# Altium project BLDC_Gimbal.PrjPcb (part 1 of 3)
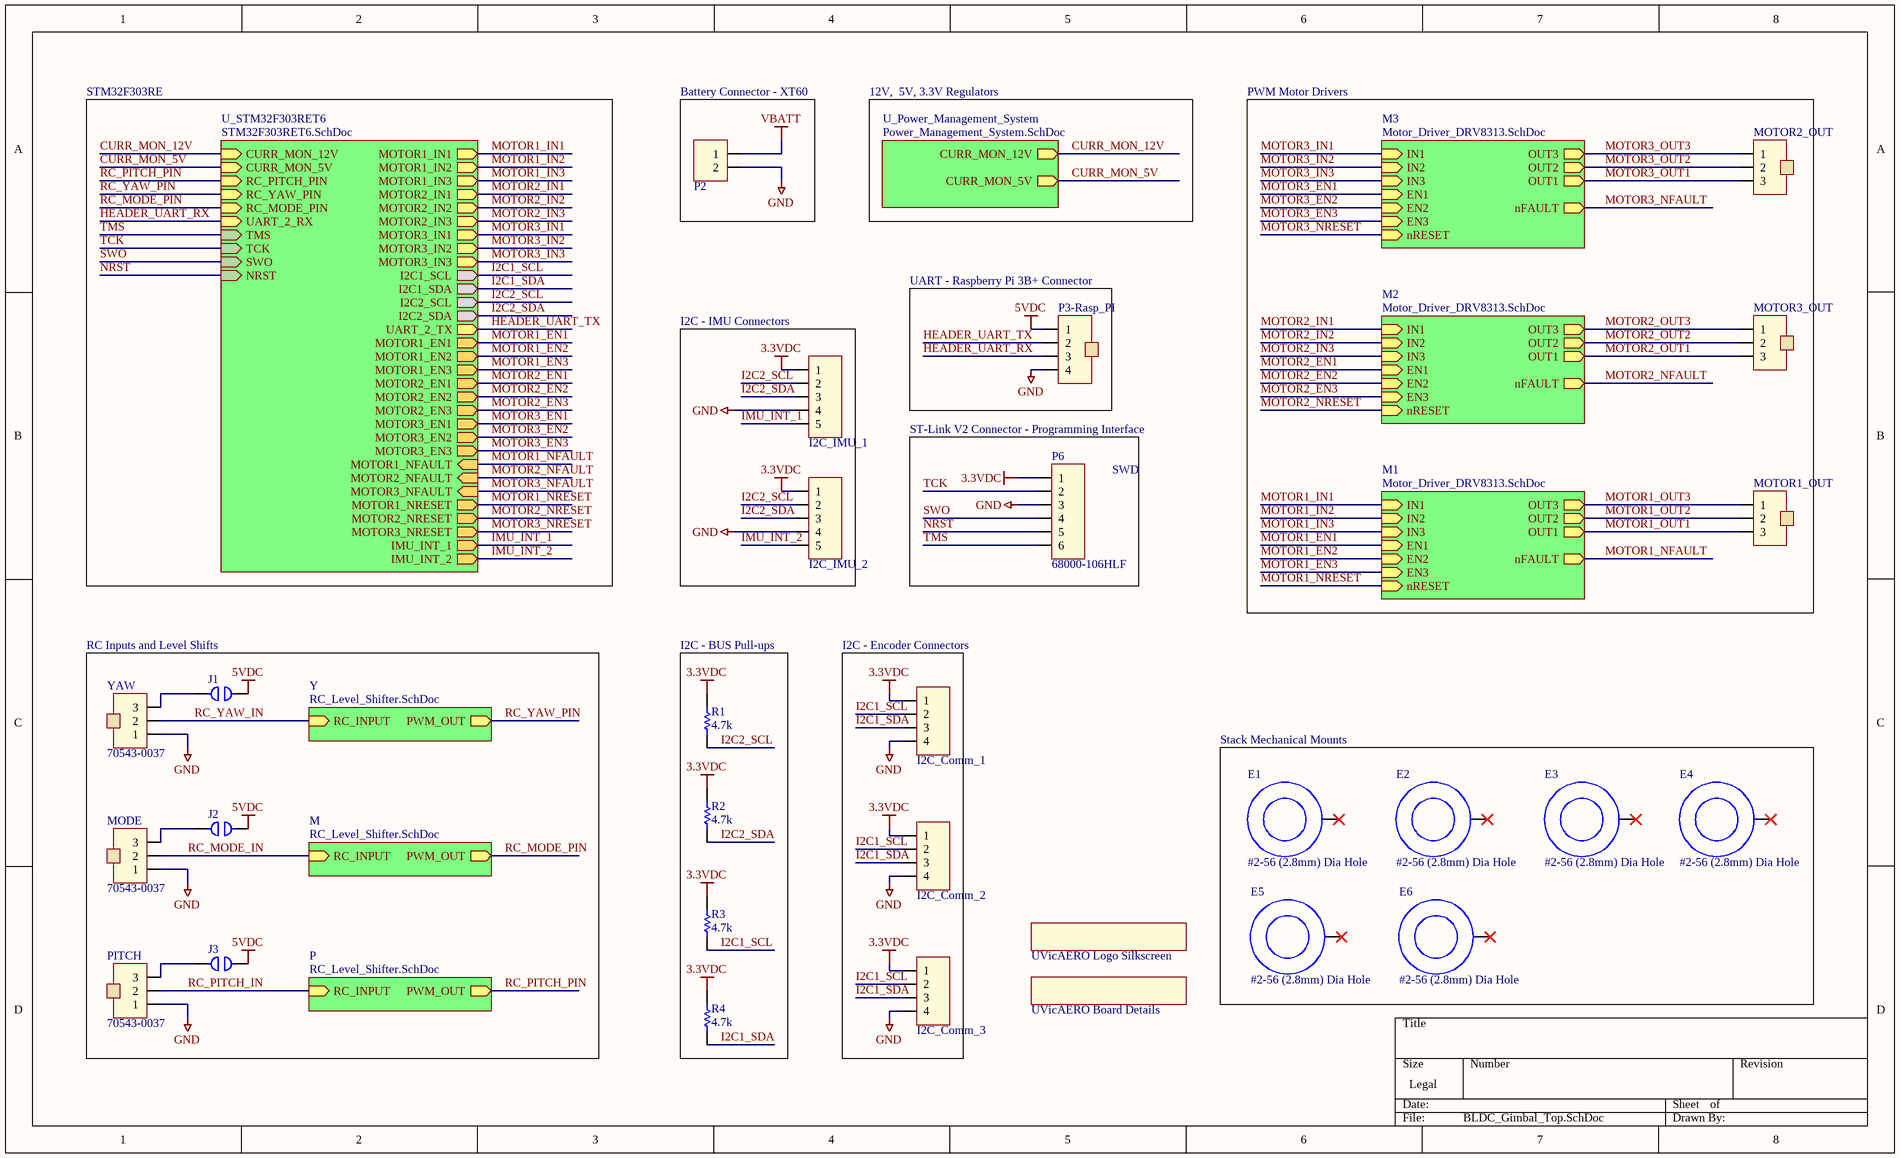
[diagram p0: BLDC_Gimbal_Top.SchDoc]
5 sheets, 131 parts. Net scope: hierarchical (ports join the sheet entries above them; power ports are global).
Board file: BLDC_Gimbal.PcbDoc
Sheets:
  BLDC_Gimbal_Top.SchDoc
    M1 = Motor_Driver_DRV8313.SchDoc
    M2 = Motor_Driver_DRV8313.SchDoc
    M3 = Motor_Driver_DRV8313.SchDoc
    U_Power_Management_System = Power_Management_System.SchDoc
    Y = RC_Level_Shifter.SchDoc
    M = RC_Level_Shifter.SchDoc
    P = RC_Level_Shifter.SchDoc
    U_STM32F303RET6 = STM32F303RET6.SchDoc

## Sheet BLDC_Gimbal_Top.SchDoc: BLDC_Gimbal_Top
size Legal; Date: 2019-06-12; CompanyName: UVic AERO; Engineer: Alexander Cote; DocumentNumber: 1; SheetNumber: 1; SheetTotal: 5

### Parts
E1  #2-56 (2.8mm) Dia Hole  [2-56, Mounting Hole]  (no BOM)
E2  #2-56 (2.8mm) Dia Hole  [2-56, Mounting Hole]  (no BOM)
E3  #2-56 (2.8mm) Dia Hole  [2-56, Mounting Hole]  (no BOM)
E4  #2-56 (2.8mm) Dia Hole  [2-56, Mounting Hole]  (no BOM)
E5  #2-56 (2.8mm) Dia Hole  [2-56, Mounting Hole]  (no BOM)
E6  #2-56 (2.8mm) Dia Hole  [2-56, Mounting Hole]  (no BOM)
I2C_Comm_1  B4B-ZR-SM4-TF(LF)(SN)  [1x4-PIN ZH 1.5mm Pitch]  (value not drawn)
I2C_Comm_2  B4B-ZR-SM4-TF(LF)(SN)  [1x4-PIN ZH 1.5mm Pitch]  (value not drawn)
I2C_Comm_3  B4B-ZR-SM4-TF(LF)(SN)  [1x4-PIN ZH 1.5mm Pitch]  (value not drawn)
I2C_IMU_1  B5B-ZR-SM4-TF(LF)(SN)  [1x5-PIN ZH 1.5mm Pitch]  (value not drawn)
I2C_IMU_2  B5B-ZR-SM4-TF(LF)(SN)  [1x5-PIN ZH 1.5mm Pitch]  (value not drawn)
J1  3M9580-ND  [Jumper-2Pin, THT]  (value not drawn)
J2  3M9580-ND  [Jumper-2Pin, THT]  (value not drawn)
J3  3M9580-ND  [Jumper-2Pin, THT]  (value not drawn)
LB1  UVicAERO Board Details  [UVicAERO, Board Details, Silkscreen]
LB2  UVicAERO Logo Silkscreen  [UVicAERO_Logo, 7mm Width]
MODE  70543-0037  [Header-3Pin, THT, Shrouded]
MOTOR1_OUT  70543-0037  [Header-3Pin, THT, Shrouded]  (value not drawn)
MOTOR2_OUT  70543-0037  [Header-3Pin, THT, Shrouded]  (value not drawn)
MOTOR3_OUT  70543-0037  [Header-3Pin, THT, Shrouded]  (value not drawn)
P2  2x1-Pin, Pitch: 3.00mm, Battery Connector  [XT60]  (value not drawn)
P3-Rasp_PI  43045-0412  [Header-4Pin, 2x2, THT, Locking, Tin]  (value not drawn)
P6  68000-106HLF  [Header-6Pin, THT]
PITCH  70543-0037  [Header-3Pin, THT, Shrouded]
R1  4.7k  [RESC2012N(0805")]
R2  4.7k  [RESC2012N(0805")]
R3  4.7k  [RESC2012N(0805")]
R4  4.7k  [RESC2012N(0805")]
YAW  70543-0037  [Header-3Pin, THT, Shrouded]

### Blocks framed on the sheet
Battery Connector - XT60: P2
PWM Motor Drivers: MOTOR1_OUT MOTOR2_OUT MOTOR3_OUT
UART - Raspberry Pi 3B+ Connector: P3-Rasp_PI
I2C - IMU Connectors: I2C_IMU_1 I2C_IMU_2
RC Inputs and Level Shifts: J1-J3 MODE PITCH YAW
I2C - BUS Pull-ups: R1-R4
I2C - Encoder Connectors: I2C_Comm_1-I2C_Comm_3
Stack Mechanical Mounts: E1-E6

### Sub-sheets
M = RC_Level_Shifter.SchDoc: RC_INPUT (in), PWM_OUT (out)
M1 = Motor_Driver_DRV8313.SchDoc: nFAULT (out), OUT1 (out), OUT2 (out), OUT3 (out), IN1 (in), IN2 (in), IN3 (in), EN1 (in), EN2 (in), EN3 (in), nRESET (in)
M2 = Motor_Driver_DRV8313.SchDoc: nFAULT (out), OUT1 (out), OUT2 (out), OUT3 (out), IN1 (in), IN2 (in), IN3 (in), EN1 (in), EN2 (in), EN3 (in), nRESET (in)
M3 = Motor_Driver_DRV8313.SchDoc: nFAULT (out), OUT1 (out), OUT2 (out), OUT3 (out), IN1 (in), IN2 (in), IN3 (in), EN1 (in), EN2 (in), EN3 (in), nRESET (in)
P = RC_Level_Shifter.SchDoc: RC_INPUT (in), PWM_OUT (out)
U_Power_Management_System = Power_Management_System.SchDoc: CURR_MON_12V (out), CURR_MON_5V (out)
U_STM32F303RET6 = STM32F303RET6.SchDoc: MOTOR1_IN1 (out), MOTOR1_IN2 (out), MOTOR1_IN3 (out), MOTOR2_IN1 (out), MOTOR2_IN2 (out), MOTOR2_IN3 (out), MOTOR3_IN1 (out), MOTOR3_IN2 (out), MOTOR3_IN3 (out), I2C1_SCL (out), I2C1_SDA (out), I2C2_SCL (out), I2C2_SDA (out), CURR_MON_12V (in), CURR_MON_5V (in), RC_PITCH_PIN (in), RC_YAW_PIN (in), RC_MODE_PIN (in), UART_2_TX (out), UART_2_RX (in), MOTOR1_EN1 (out), MOTOR1_EN2 (out), MOTOR1_EN3 (out), MOTOR2_EN1 (out), MOTOR2_EN2 (out), MOTOR2_EN3 (out), MOTOR3_EN1 (out), MOTOR3_EN2 (out), MOTOR3_EN3 (out), MOTOR1_NFAULT (in), MOTOR2_NFAULT (in), MOTOR3_NFAULT (in), MOTOR1_NRESET (out), MOTOR2_NRESET (out), MOTOR3_NRESET (out), IMU_INT_1 (out), IMU_INT_2 (out), TMS (in), TCK (in), SWO (in), NRST (in)
Y = RC_Level_Shifter.SchDoc: RC_INPUT (in), PWM_OUT (out)

### Nets
3.3VDC: I2C_Comm_1.1 I2C_Comm_2.1 I2C_Comm_3.1 I2C_IMU_1.1 I2C_IMU_2.1 P6.1 R1.2 R2.2 R3.2 R4.2
5VDC: J1.2 J2.2 J3.2 P3-Rasp_PI.1
GND: I2C_Comm_1.4 I2C_Comm_2.4 I2C_Comm_3.4 I2C_IMU_1.4 I2C_IMU_2.4 MODE.1 P2.2 P3-Rasp_PI.4 P6.3 PITCH.1 YAW.1
VBATT: P2.1
CURR_MON_5V: sheet U_Power_Management_System/CURR_MON_5V, sheet U_STM32F303RET6/CURR_MON_5V
CURR_MON_12V: sheet U_Power_Management_System/CURR_MON_12V, sheet U_STM32F303RET6/CURR_MON_12V
HEADER_UART_RX: P3-Rasp_PI.3 ; sheet U_STM32F303RET6/UART_2_RX
HEADER_UART_TX: P3-Rasp_PI.2 ; sheet U_STM32F303RET6/UART_2_TX
I2C1_SCL: I2C_Comm_1.2 I2C_Comm_2.2 I2C_Comm_3.2 R3.1 ; sheet U_STM32F303RET6/I2C1_SCL
I2C1_SDA: I2C_Comm_1.3 I2C_Comm_2.3 I2C_Comm_3.3 R4.1 ; sheet U_STM32F303RET6/I2C1_SDA
I2C2_SCL: I2C_IMU_1.2 I2C_IMU_2.2 R1.1 ; sheet U_STM32F303RET6/I2C2_SCL
I2C2_SDA: I2C_IMU_1.3 I2C_IMU_2.3 R2.1 ; sheet U_STM32F303RET6/I2C2_SDA
IMU_INT_1: I2C_IMU_1.5 ; sheet U_STM32F303RET6/IMU_INT_1
IMU_INT_2: I2C_IMU_2.5 ; sheet U_STM32F303RET6/IMU_INT_2
MOTOR1_EN1: sheet M1/EN1, sheet U_STM32F303RET6/MOTOR1_EN1
MOTOR1_EN2: sheet M1/EN2, sheet U_STM32F303RET6/MOTOR1_EN2
MOTOR1_EN3: sheet M1/EN3, sheet U_STM32F303RET6/MOTOR1_EN3
MOTOR1_IN1: sheet M1/IN1, sheet U_STM32F303RET6/MOTOR1_IN1
MOTOR1_IN2: sheet M1/IN2, sheet U_STM32F303RET6/MOTOR1_IN2
MOTOR1_IN3: sheet M1/IN3, sheet U_STM32F303RET6/MOTOR1_IN3
MOTOR1_NFAULT: sheet M1/nFAULT, sheet U_STM32F303RET6/MOTOR1_NFAULT
MOTOR1_NRESET: sheet M1/nRESET, sheet U_STM32F303RET6/MOTOR1_NRESET
MOTOR1_OUT1: MOTOR1_OUT.3 ; sheet M1/OUT1
MOTOR1_OUT2: MOTOR1_OUT.2 ; sheet M1/OUT2
MOTOR1_OUT3: MOTOR1_OUT.1 ; sheet M1/OUT3
MOTOR2_EN1: sheet M2/EN1, sheet U_STM32F303RET6/MOTOR2_EN1
MOTOR2_EN2: sheet M2/EN2, sheet U_STM32F303RET6/MOTOR2_EN2
MOTOR2_EN3: sheet M2/EN3, sheet U_STM32F303RET6/MOTOR2_EN3
MOTOR2_IN1: sheet M2/IN1, sheet U_STM32F303RET6/MOTOR2_IN1
MOTOR2_IN2: sheet M2/IN2, sheet U_STM32F303RET6/MOTOR2_IN2
MOTOR2_IN3: sheet M2/IN3, sheet U_STM32F303RET6/MOTOR2_IN3
MOTOR2_NFAULT: sheet M2/nFAULT, sheet U_STM32F303RET6/MOTOR2_NFAULT
MOTOR2_NRESET: sheet M2/nRESET, sheet U_STM32F303RET6/MOTOR2_NRESET
MOTOR2_OUT1: MOTOR3_OUT.3 ; sheet M2/OUT1
MOTOR2_OUT2: MOTOR3_OUT.2 ; sheet M2/OUT2
MOTOR2_OUT3: MOTOR3_OUT.1 ; sheet M2/OUT3
MOTOR3_EN1: sheet M3/EN1, sheet U_STM32F303RET6/MOTOR3_EN1
MOTOR3_EN2: sheet M3/EN2, sheet U_STM32F303RET6/MOTOR3_EN2
MOTOR3_EN3: sheet M3/EN3, sheet U_STM32F303RET6/MOTOR3_EN3
MOTOR3_IN1: sheet M3/IN1, sheet U_STM32F303RET6/MOTOR3_IN1
MOTOR3_IN2: sheet M3/IN2, sheet U_STM32F303RET6/MOTOR3_IN2
MOTOR3_IN3: sheet M3/IN3, sheet U_STM32F303RET6/MOTOR3_IN3
MOTOR3_NFAULT: sheet M3/nFAULT, sheet U_STM32F303RET6/MOTOR3_NFAULT
MOTOR3_NRESET: sheet M3/nRESET, sheet U_STM32F303RET6/MOTOR3_NRESET
MOTOR3_OUT1: MOTOR2_OUT.3 ; sheet M3/OUT1
MOTOR3_OUT2: MOTOR2_OUT.2 ; sheet M3/OUT2
MOTOR3_OUT3: MOTOR2_OUT.1 ; sheet M3/OUT3
NRST: P6.5 ; sheet U_STM32F303RET6/NRST
RC_MODE_IN: MODE.2 ; sheet M/RC_INPUT
RC_MODE_PIN: sheet M/PWM_OUT, sheet U_STM32F303RET6/RC_MODE_PIN
RC_PITCH_IN: PITCH.2 ; sheet P/RC_INPUT
RC_PITCH_PIN: sheet P/PWM_OUT, sheet U_STM32F303RET6/RC_PITCH_PIN
RC_YAW_IN: YAW.2 ; sheet Y/RC_INPUT
RC_YAW_PIN: sheet Y/PWM_OUT, sheet U_STM32F303RET6/RC_YAW_PIN
SWO: P6.4 ; sheet U_STM32F303RET6/SWO
TCK: P6.2 ; sheet U_STM32F303RET6/TCK
TMS: P6.6 ; sheet U_STM32F303RET6/TMS
NetJ1_1: J1.1 YAW.3
NetJ2_1: J2.1 MODE.3
NetJ3_1: J3.1 PITCH.3

Not connected (* = marked no-connect by the designer): E1 0*; E2 0*; E3 0*; E4 0*; E5 0*; E6 0*

### Notes on the sheet
- STM32F303RE
- 12V,  5V, 3.3V Regulators
- ST-Link V2 Connector - Programming Interface
- (near P6) SWD
- Title
- Size:
- Date:
- Legal
- Number:
- Time:
- Revision:
- Sheet
- of
- File:

### Library data of the parts
E1-E6 = #2-56, w-Pin, Mounting Hole: #2-56, with Pin, Mounting Hole; Publisher: UVic AERO, KCMR; Published: Feb 8, 2014
I2C_Comm_1-I2C_Comm_3 = B4B-ZR-SM4-TF(LF)(SN): Conn Shrouded Header HDR 4 POS 1.5mm Solder ST SMD T/R; Manufacturer: JST; Number of Positions: 4; Current Rating: 1A; Gender: Male; Connector Type: Male Pin; Contact Resistance: 30mR; Max Voltage Rating (AC): 50V; Supplier 1: Digi-Key; Manufacturer Part Number: B4B-ZR-SM4-TF(LF)(SN); Stock 1: 27718; Pricing 1: 1 = 0.71000, 10 = 0.67000, 100 = 0.51380, 500 = 0.44682 (USD); RoHS: Yes; Mount: Surface Mount; Contact Plating: Tin; Contact Material: Tin; Color: Natural; Housing Color: Beige; Housing Material: Polyamide; Min Operating Temperature: -25°C; Max Operating Temperature: 85°C; Number of Rows: 1; Packaging: Tape and Reel; Termination: Solder; Number of Contacts: 4; Max Current Rating: 1A; Fastening Type: Detent; Orientation: Straight; Length: 9mm; Height: 7.2mm; Pitch: 1.5mm; Width: 3.5mm; Depth: 3.7mm; Lead Free: Lead Free; ComponentLink1URL: https://datasheet.ciiva.com/26924/getdatasheetpartid-640935-26924037.pdf?src-supplier=Verical; ComponentLink1Description: https://datasheet.ciiva.com/26924/getdatasheetpartid-640935-26924037.pdf?src-supplier=Verical; Supplier Part Number 1: 455-1683-1-ND
I2C_IMU_1 I2C_IMU_2 = B5B-ZR-SM4-TF(LF)(SN): CONN HEADER ZH TOP 5POS 1.5MM; Manufacturer: JST; Number of Positions: 5; Gender: Male; Current Rating: 1A; Connector Type: Male Pin; Pitch: 0.059inch; Supplier 1: Digi-Key; Manufacturer Part Number: B5B-ZR-SM4-TF(LF)(SN); Stock 1: 52019; Pricing 1: 1 = 0.790000, 10 = 0.742000, 100 = 0.568600, 500 = 0.494420 (USD); RoHS: Yes; Mount: Surface Mount; Contact Material: Tin; Contact Plating: Tin; Housing Color: Natural; Housing Material: Nylon; Color: Natural; Number of Rows: 1; Packaging: Tape and Reel; Number of Contacts: 5; Termination: Solder; Fastening Type: Detent; Length: 10.5mm; Height: 7.2mm; Width: 3.5mm; Lead Free: Lead Free; ComponentLink1URL: http://www.jst-mfg.com/product/pdf/eng/eZH.pdf?src-supplier=Digi-Key; ComponentLink1Description: http://www.jst-mfg.com/product/pdf/eng/eZH.pdf?src-supplier=Digi-Key; ComponentLink2URL: http://www.jst-mfg.com/product/pdf/eng/eZR.pdf?src-supplier=Future+Electronics; ComponentLink2Description: http://www.jst-mfg.com/product/pdf/eng/eZR.pdf?src-supplier=Future+Electronics; Supplier Part Number 1: 455-1684-1-ND
J1-J3 = Jumper, 0.1" (2.54mm), Gold, THT, 68001-202HLF: Jumper, 0.1" (2.54mm), Gold, THT, 68001-202HLF & 3M9580-ND; Mfg: FCI; Publisher: UVic AERO, Kirk Richardson; Published: 2014-10-19; LatestRevisionNote: *; LatestRevisionDate: *; Mfg#: 68001-202HLF; Verified: No; ReviewedBy: *; ReviewedDate: *; LatestRevisionBy: *; Supplier 1: Digi-Key; Supplier 2: Digi-Key; Supplier Part Number 1: 3M9580-ND; Supplier Part Number 2: 609-3469-ND
LB1 = Logo, UVic AERO, Board Details: Logo, UVic AERO, Board Details, Silkscreen; Publisher: UVic AERO, KCMR; Published: Feb 14, 2014
LB2 = Logo, UVic AERO 2014, 7mm: Logo, UVic AERO 2014, 7mm Width, Silkscreen; Publisher: UVic AERO, KCMR; Published: Feb 14, 2014
MODE MOTOR1_OUT MOTOR2_OUT MOTOR3_OUT PITCH YAW = 1x3-Pin, Pitch: 0.1" (2.54mm), Tin, THT, Shrouded, Locking, 70543-0037: Mfg: Molex Inc; ReviewedBy: Matthew Fitz; ReviewedNote: There should be tin pins instead of gold; Publisher: UVic AERO, Kirk Richardson; Published: 2014-03-16; LatestRevisionNote: Changed # of pins from 4 to 3; LatestRevisionDate: 2014-03-18; Mfg#: 70543-0037; ReviewedDate: 2014-03-19; Verified: Yes; Supplier 1: Digi-Key; Supplier Part Number 1: WM4825-ND; LatestRevisionBy: *
P2 = 2x1-Pin, Pitch: 3.00mm, Battery Connector: XT60 - 2x1-Pin, Pitch: 3.00mm, Battery Connector; Publisher: UVic AERO, Luke Mills; Published: 2016-12-15; ReviewedBy: *; ReviewedDate: *; Verified: *
P3-Rasp_PI = 2x2-Pin, Pitch: 3.00mm, Tin, THT, 43045-0412: 2x2-Pin, Pitch: 3.00mm, Tin, THT, Shrouded, Locking, 43045-0412; Mfg: Molex; ReviewedBy: Kirk Richardson; Publisher: UVic AERO, Taylor Eby; Published: 2014-03-13; LatestRevisionNote: Fixed footprint so it's aligned to pin 1; LatestRevisionDate: 2014-03-23; ReviewedDate: 2014-03-23; Verified: Yes; Supplier 1: Digi-Key; Supplier Part Number 1: WM1790-ND; Mfg#: 43045-0412; LatestRevisionBy: Kirk Richardson; ReviewedNote: *
P6 = Header, 1x6-Pin, Pitch: 0.1" (2.54mm), Gold 30µin, THT, 68000-106HLF: Mfg: FCI; Publisher: UVic AERO, Kirk Richardson; Published: 2014-03-16; LatestRevisionNote: *; LatestRevisionDate: *; ReviewedBy: *; ReviewedDate: *; Verified: No; Mfg#: 68000-106HLF; LatestRevisionBy: *; Supplier 1: Digi-Key; Supplier Part Number 1: 609-3249-ND
R1-R4 = RC0805FR-074K7L: RES SMD 4.7k ohm, 150 V, 0805 [2012 Metric], 250 mW,  1%; Manufacturer: Yageo; Resistance: 4.7kR; Temperature Coefficient: 100ppm/°C; Voltage Rating (DC): 150V; Power Rating: 125mW; Supplier 1: Digi-Key; Manufacturer Part Number: RC0805FR-074K7L; Stock 1: 5392599; Pricing 1: 1 = 0.10000, 10 = 0.04200, 100 = 0.01700, 1000 = 0.00762, 2500 = 0.00662 (USD); RoHS: Yes; Case/Package: 0805; Number of Pins: 2; Case Code (Metric): 2012; Case Code (Imperial): 0805; Min Operating Temperature: -55°C; Max Operating Temperature: 155°C; Tolerance: 1%; Composition: Thick Film; Packaging: Tape and Reel; Package Quantity: 5000; Voltage Rating: 150V; Number of Terminations: 2; Termination: SMD/SMT; Military Standard: Not; Max Power Dissipation: 125mW; Features: Moisture Resistant; Length: 0.079inch; Height: 0.024inch; Width: 0.049inch; Depth: 1.25mm; REACH SVHC: No SVHC; Lead Free: Lead Free; ComponentLink1URL: https://datasheet.ciiva.com/11808/0900766b8106beab-11808155.pdf?src-supplier=RSComponents; ComponentLink1Description: https://datasheet.ciiva.com/11808/0900766b8106beab-11808155.pdf?src-supplier=RSComponents; ComponentLink2URL: https://datasheet.ciiva.com/7941/1686128-7941805.pdf?src-supplier=Element14; ComponentLink2Description: https://datasheet.ciiva.com/7941/1686128-7941805.pdf?src-supplier=Element14; ComponentLink3URL: https://datasheet.ciiva.com/7941/444164-7941806.pdf?src-supplier=Element14; ComponentLink3Description: https://datasheet.ciiva.com/7941/444164-7941806.pdf?src-supplier=Element14; ComponentLink4URL: https://datasheet.ciiva.com/6547/pyu-r-int-thick-7-6547263.pdf?src-supplier=Digi-Key; ComponentLink4Description: https://datasheet.ciiva.com/6547/pyu-r-int-thick-7-6547263.pdf?src-supplier=Digi-Key; ComponentLink5URL: https://datasheet.ciiva.com/7941/444164-7941804.pdf?src-supplier=Element14; ComponentLink5Description: https://datasheet.ciiva.com/7941/444164-7941804.pdf?src-supplier=Element14; ComponentLink6URL: https://datasheet.ciiva.com/46447/444164-46447583.pdf?src-supplier=Element14; ComponentLink6Description: https://datasheet.ciiva.com/46447/444164-46447583.pdf?src-supplier=Element14; Supplier Part Number 1: 311-4.70KCRCT-ND

## Sheet Motor_Driver_DRV8313.SchDoc
size A4; CheckedBy: Jake Vidal, Noah Rondeau, Alexander Cote; DrawnBy: Alexander Cote; DocumentNumber: 2; Revision: 1.3; SheetNumber: 2; SheetTotal: 5
Used 3 times, as channels M1, M2, M3. Parts and nets are listed once, with the designators drawn on the sheet.
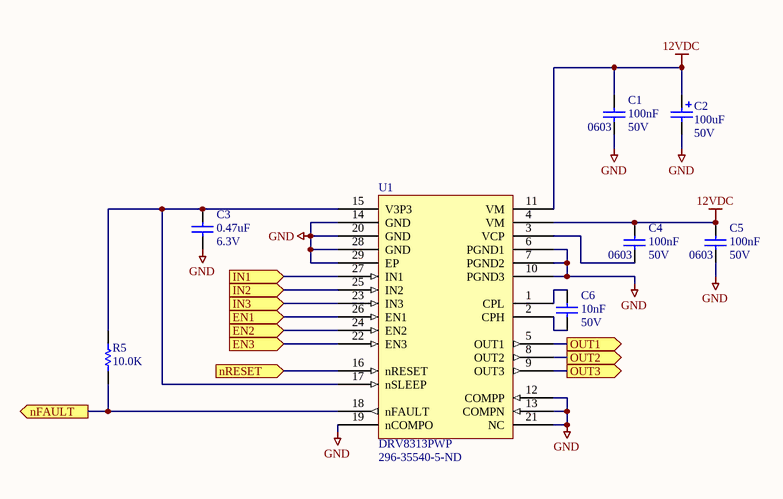
[diagram p1: Motor_Driver_DRV8313.SchDoc]

### Parts
C1  100nF  Case Code (Imperial): 0603  Voltage Rating: 50V  [CAPC1608N(0603")]
C2  100uF  Voltage: 50V  [CAPAE10083X105M]
C3  0.47uF  Voltage: 6.3V  [CAPC1608N(0603")]
C4  100nF  Case Code (Imperial): 0603  Voltage Rating: 50V  [CAPC1608N(0603")]
C5  100nF  Case Code (Imperial): 0603  Voltage Rating: 50V  [CAPC1608N(0603")]
C6  10nF  Voltage: 50V  [CAPC1608N(0603")]
R5  10.0K  [RESC1608N(0603")]
U1  DRV8313PWP  Supplier Part Number 1: 296-35540-5-ND  [HTSSOP-28]

### Ports
EN1 (in), EN2 (in), EN3 (in), IN1 (in), IN2 (in), IN3 (in), nFAULT (out), nRESET (in), OUT1 (out), OUT2 (out), OUT3 (out)

### Nets
12VDC: C1.2 C2.1 C4.2 C5.2 U1.4(VM) U1.11(VM)
GND: C1.1 C2.2 C3.2 C5.1 U1.6(PGND1) U1.7(PGND2) U1.10(PGND3) U1.12(COMPP) U1.13(COMPN) U1.14(GND) U1.19(nCOMPO) U1.20(GND) U1.21(NC) U1.28(GND) U1.29(EP)
EN1: U1.26(EN1) ; port EN1
EN2: U1.24(EN2) ; port EN2
EN3: U1.22(EN3) ; port EN3
IN1: U1.27(IN1) ; port IN1
IN2: U1.25(IN2) ; port IN2
IN3: U1.23(IN3) ; port IN3
nFAULT: R5.1 U1.18(nFAULT) ; port nFAULT
nRESET: U1.16(nRESET) ; port nRESET
OUT1: U1.5(OUT1) ; port OUT1
OUT2: U1.8(OUT2) ; port OUT2
OUT3: U1.9(OUT3) ; port OUT3
NetC3_1: C3.1 R5.2 U1.15(V3P3) U1.17(nSLEEP)
NetC4_1: C4.1 U1.3(VCP)
NetC6_1: C6.1 U1.2(CPH)
NetC6_2: C6.2 U1.1(CPL)

### Channels
M1: designators end in _Motor1_Pitch; ports EN1=MOTOR1_EN1 EN2=MOTOR1_EN2 EN3=MOTOR1_EN3 IN1=MOTOR1_IN1 IN2=MOTOR1_IN2 IN3=MOTOR1_IN3 nFAULT=MOTOR1_NFAULT nRESET=MOTOR1_NRESET OUT1=MOTOR1_OUT1 OUT2=MOTOR1_OUT2 OUT3=MOTOR1_OUT3
M2: designators end in _Motor2; ports EN1=MOTOR2_EN1 EN2=MOTOR2_EN2 EN3=MOTOR2_EN3 IN1=MOTOR2_IN1 IN2=MOTOR2_IN2 IN3=MOTOR2_IN3 nFAULT=MOTOR2_NFAULT nRESET=MOTOR2_NRESET OUT1=MOTOR2_OUT1 OUT2=MOTOR2_OUT2 OUT3=MOTOR2_OUT3
M3: designators end in _Motor3; ports EN1=MOTOR3_EN1 EN2=MOTOR3_EN2 EN3=MOTOR3_EN3 IN1=MOTOR3_IN1 IN2=MOTOR3_IN2 IN3=MOTOR3_IN3 nFAULT=MOTOR3_NFAULT nRESET=MOTOR3_NRESET OUT1=MOTOR3_OUT1 OUT2=MOTOR3_OUT2 OUT3=MOTOR3_OUT3

### Library data of the parts
C1 C4 C5 = CL10B104KB8SFNC: CAP CER 0.1UF 50V X7R 0603; Manufacturer: Samsung; Tolerance: 10%; Supplier 1: Digi-Key; Manufacturer Part Number: CL10B104KB8SFNC; Stock 1: 1859763; Pricing 1: 1 = 0.10000, 10 = 0.02900, 100 = 0.01300, 500 = 0.00928, 1000 = 0.00729 (USD); RoHS: Yes; Mount: Surface Mount; Case/Package: 0603; Case Code (Metric): 1608; Contact Plating: Tin; Min Operating Temperature: -55°C; Max Operating Temperature: 125°C; Package Quantity: 4000; Packaging: Tape and Reel; Capacitance: 100nF; Dielectric: X7R; Features: Soft Termination; Length: 1.6mm; Height: 0.8mm; Width: 0.031inch; Thickness: 0.035inch; Depth: 0.8mm; Radiation Hardening: No; Lead Free: Lead Free; ComponentLink1URL: https://datasheet.ciiva.com/25714/cl10b104kb8sfnc-25714514.pdf?src-supplier=Digi-Key; ComponentLink1Description: https://datasheet.ciiva.com/25714/cl10b104kb8sfnc-25714514.pdf?src-supplier=Digi-Key; Supplier Part Number 1: 1276-1936-1-ND
C2 = 100uF 50V, SMD, Alum, Polarized: Capacitor, Polarized, Aluminum, 50V, +/- 20%, SMD; Mfg#: EEE-1HA101UP; Mfg: Panasonic; Published: 2017-11-16; LatestRevisionDate: 2017-11-16; Publisher: UVic AERO, Taylor Long; PackageDescription: Radial, Can - SMD; Value: 100uF; Supplier 1: Digi-Key; Supplier Part Number 1: PCE3917CT-ND
C3 = 0.47uF 6.3V 0603 SMD, Ceramic: Capacitor, Ceramic, 6.3V, +/- 10%, 0603 SMD, X7R; Mfg#: GRM188R70J474KA01D; Mfg: Murata Electronics North America; Published: 2017-11-16; LatestRevisionDate: 2017-11-16; Publisher: UVic AERO, Taylor Long; PackageDescription: Chip Capacitor; Value: 0.47uF; Supplier 1: Digi-Key; Supplier Part Number 1: 490-6416-1-ND
C6 = 10nF 50V 0603 SMD, Ceramic: Capacitor, Ceramic, 50V, +/- 10%, 0603 SMD, X7R; Published: March 28, 2012; Publisher: UVic AERO; PackageDescription: Chip Capacitor; Value: 10nF; Supplier 1: Digi-Key; Supplier Part Number 1: 399-1091-1-ND
R5 = 10.0K, 1%, 1/10 W, 0603 SMD: Resistor, 1%, 1/10 W, 0603 SMD, 10.0K, +/-100ppm/C, Thick Film; Power: 1/10W; Published: Jan 14, 2011; Publisher: TRAXX Automation Ltd.; PackageDescription: Chip Resistor; Value: 10.0K; Supplier 1: Digi-Key; Supplier Part Number 1: 311-10.0KHRCT-ND
U1 = DRV8313PWP: DRV8313 2.5-A Triple 1/2-H Bridge Driver; Mfg: Texas Instruments; Supplier 1: Digi-Key; LatestRevisionBy: *; LatestRevisionDate: *; LatestRevisionNote: *; Mfg#: DRV8313PWP; Published: 2017-11-16; Publisher: UVic AERO, Taylor Long; ReviewedBy: *; ReviewedDate: *; ReviewedNote: *; Verified: No

## Sheet Power_Management_System.SchDoc: Power Management System
size A3; CheckedBy: Jake Vidal, Noah Rondeau; Author: Alexander Cote; DrawnBy: Alexander Cote; Engineer: Alexander Cote; Organization: UVic AERO; DocumentNumber: 4; Revision: 1.1; SheetNumber: 4; SheetTotal: 5
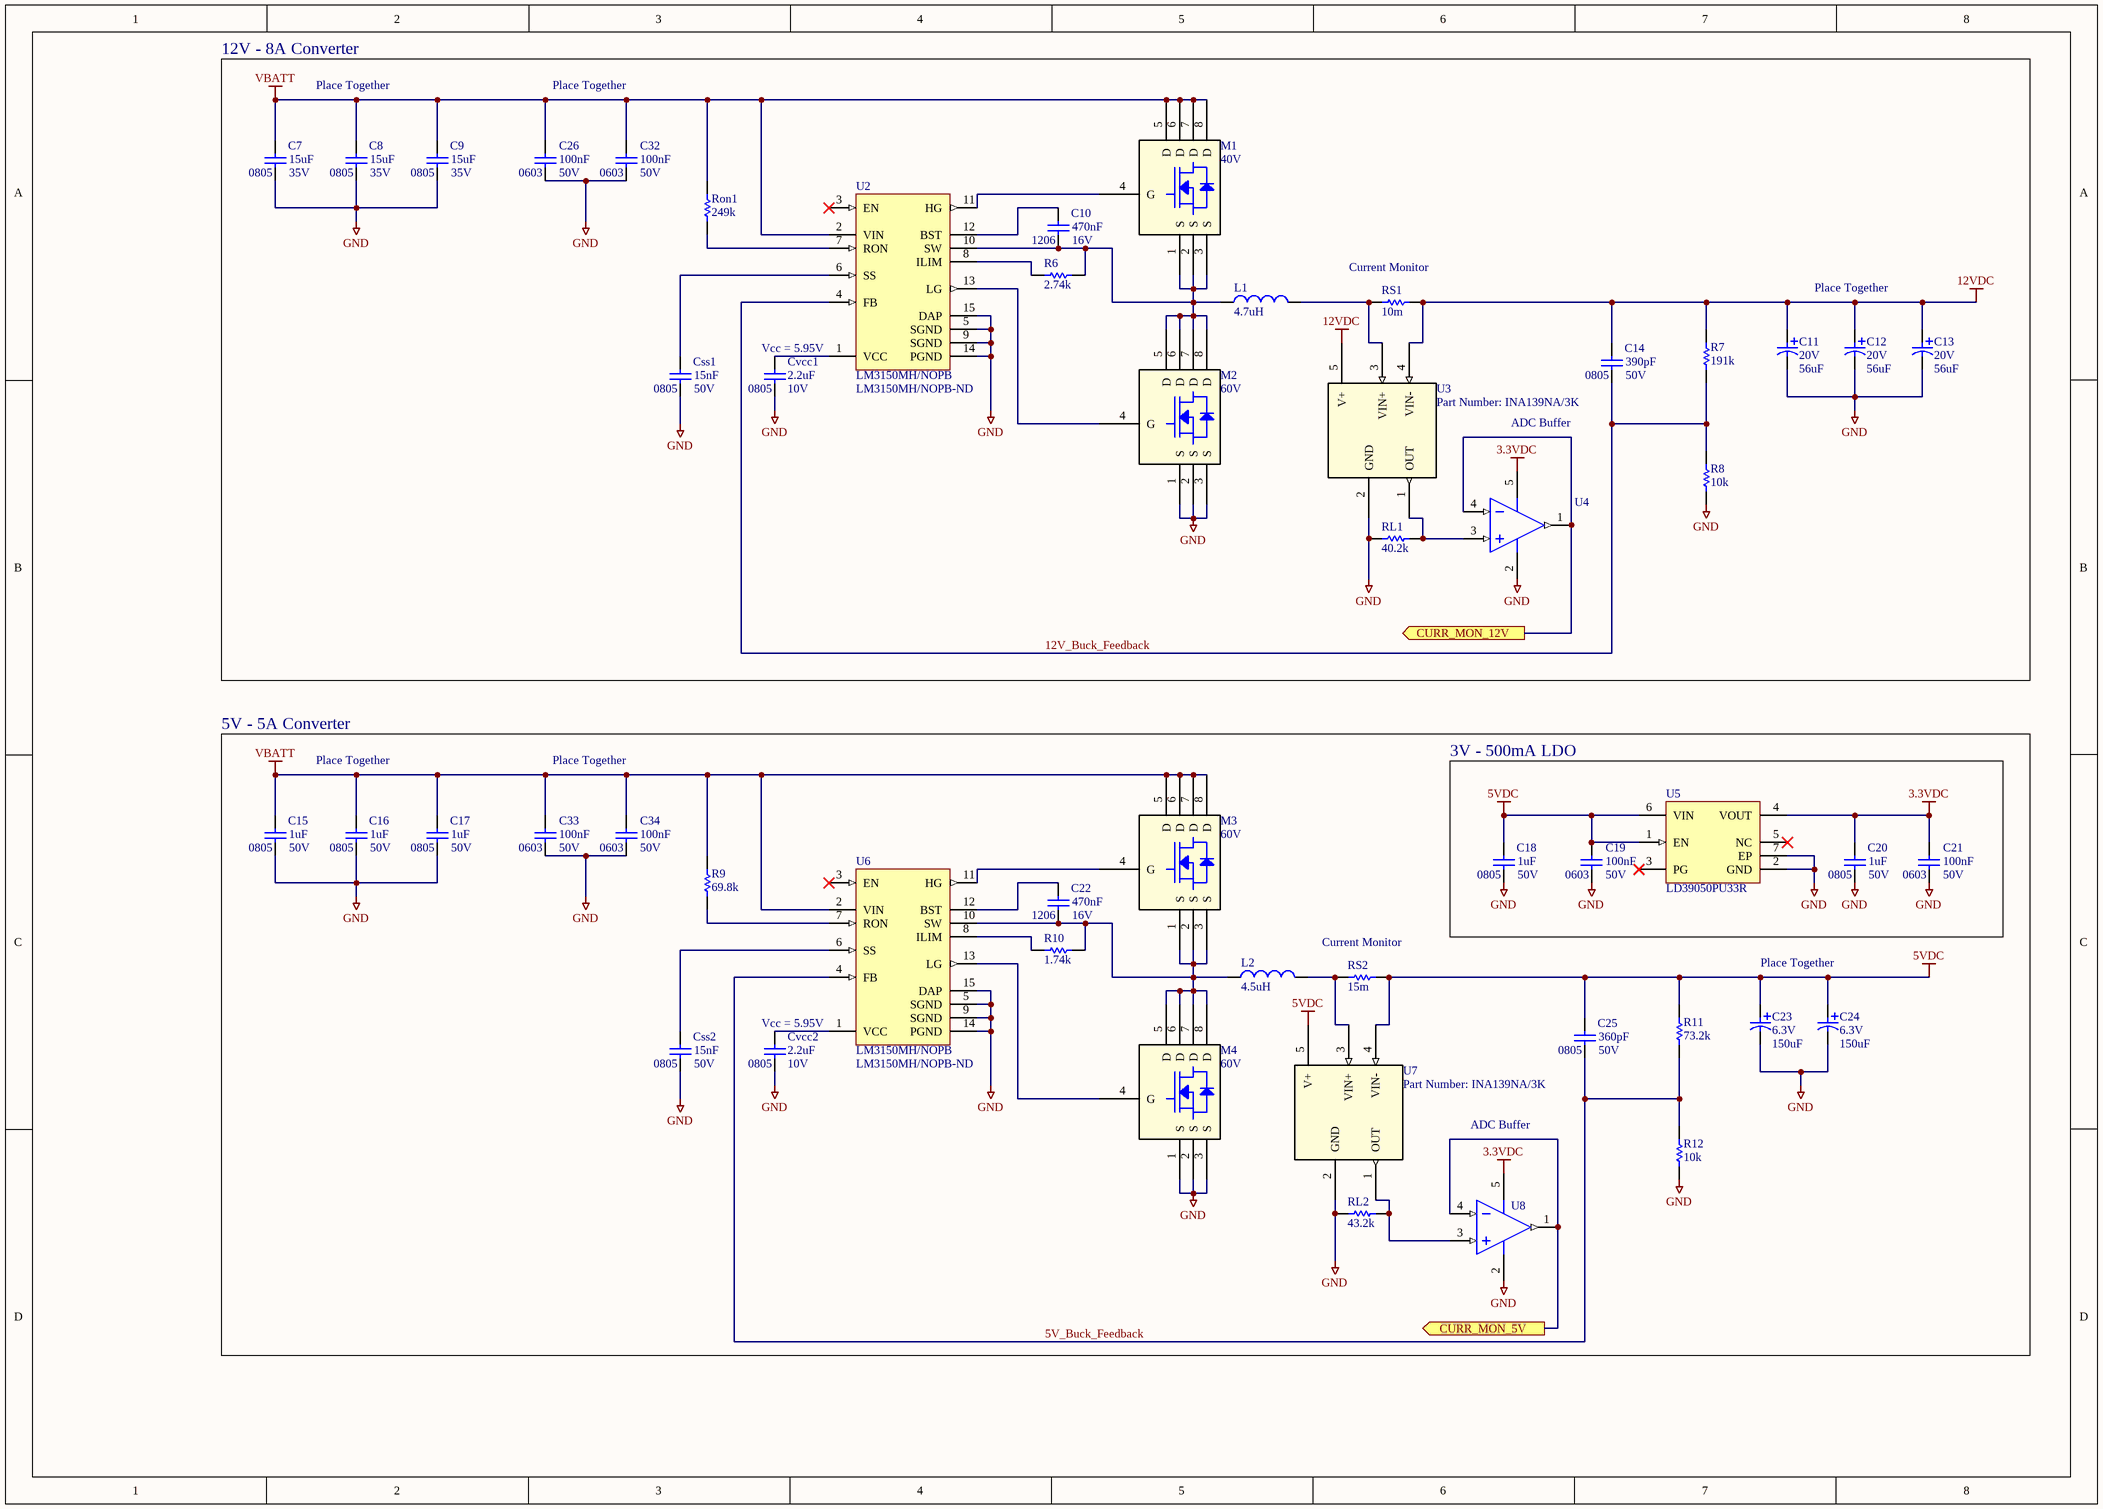
[diagram p2: Power_Management_System.SchDoc]

### Parts
C7  Voltage Rating: 35V  Case/Package: 0805  Capacitance: 15uF  [CAPC2012N(0805")]  (hidden comment: C2012X5R1V156M125AC)
C8  Voltage Rating: 35V  Case/Package: 0805  Capacitance: 15uF  [CAPC2012N(0805")]  (hidden comment: C2012X5R1V156M125AC)
C9  Voltage Rating: 35V  Case/Package: 0805  Capacitance: 15uF  [CAPC2012N(0805")]  (hidden comment: C2012X5R1V156M125AC)
C10  Voltage Rating: 16V  Case Code (Imperial): 1206  Capacitance: 470nF  [CAPC3216N(1206")]  (hidden comment: ECP-U1C474MA5)
C11  Voltage: 20V  Capacitance: 56uF  [PCAP_SVP_B6-M]  (hidden comment: 20SVPF56MX)
C12  Voltage: 20V  Capacitance: 56uF  [PCAP_SVP_B6-M]  (hidden comment: 20SVPF56MX)
C13  Voltage: 20V  Capacitance: 56uF  [PCAP_SVP_B6-M]  (hidden comment: 20SVPF56MX)
C14  Voltage: 50V  Case/Package: 0805  Capacitance: 390pF  [CAPC2012N(0805")]  (hidden comment: C0805C391J5GACTU)
C15  Voltage Rating: 50V  Case/Package: 0805  Capacitance: 1uF  [CAPC2012N(0805")]  (hidden comment: CL21A105KBCLNNC)
C16  Voltage Rating: 50V  Case/Package: 0805  Capacitance: 1uF  [CAPC2012N(0805")]  (hidden comment: CL21A105KBCLNNC)
C17  Voltage Rating: 50V  Case/Package: 0805  Capacitance: 1uF  [CAPC2012N(0805")]  (hidden comment: CL21A105KBCLNNC)
C18  Voltage Rating: 50V  Case/Package: 0805  Capacitance: 1uF  [CAPC2012N(0805")]  (hidden comment: CL21A105KBCLNNC)
C19  100nF  Case Code (Imperial): 0603  Voltage Rating: 50V  [CAPC1608N(0603")]
C20  Voltage Rating: 50V  Case/Package: 0805  Capacitance: 1uF  [CAPC2012N(0805")]  (hidden comment: CL21A105KBCLNNC)
C21  100nF  Case Code (Imperial): 0603  Voltage Rating: 50V  [CAPC1608N(0603")]
C22  Voltage Rating: 16V  Case Code (Imperial): 1206  Capacitance: 470nF  [CAPC3216N(1206")]  (hidden comment: ECP-U1C474MA5)
C23  Voltage: 6.3V  Capacitance: 150uF  [PCAP_SVP_B6-M]  (hidden comment: 6SVPE150M)
C24  Voltage: 6.3V  Capacitance: 150uF  [PCAP_SVP_B6-M]  (hidden comment: 6SVPE150M)
C25  Voltage Rating: 50V  Case/Package: 0805  Capacitance: 360pF  [CAPC2012N(0805")]  (hidden comment: CL21C361JBANNNC)
C26  100nF  Case Code (Imperial): 0603  Voltage Rating: 50V  [CAPC1608N(0603")]
C32  100nF  Case Code (Imperial): 0603  Voltage Rating: 50V  [CAPC1608N(0603")]
C33  100nF  Case Code (Imperial): 0603  Voltage Rating: 50V  [CAPC1608N(0603")]
C34  100nF  Case Code (Imperial): 0603  Voltage Rating: 50V  [CAPC1608N(0603")]
Css1  Voltage Rating: 50V  Case/Package: 0805  Capacitance: 15nF  [CAPC2012N(0805")]  (hidden comment: CGA4F2C0G1H153J085AA)
Css2  Voltage Rating: 50V  Case/Package: 0805  Capacitance: 15nF  [CAPC2012N(0805")]  (hidden comment: CGA4F2C0G1H153J085AA)
Cvcc1  Capacitance: 2.2uF  Voltage Rating: 10V  Case/Package: 0805  [CAPC2012N(0805")]  (hidden comment: LMK212B7225KG-T)
Cvcc2  Capacitance: 2.2uF  Voltage Rating: 10V  Case/Package: 0805  [CAPC2012N(0805")]  (hidden comment: LMK212B7225KG-T)
L1  Inductance: 4.7uH  [IND_BOURNS_SRP01_large]  (hidden comment: SRP1270-4R7M)
L2  Inductance: 4.5uH  [IND_BOURNS_SRR12]  (hidden comment: SRR1208-4R5ML)
M1  Drain to Source Voltage (Vdss): 40V  [DQJ8]  (hidden comment: CSD18504Q5A)
M2  Drain to Source Voltage (Vdss): 60V  [DQJ8]  (hidden comment: CSD18537NQ5A)
M3  Drain to Source Voltage (Vdss): 60V  [DQJ8]  (hidden comment: CSD18537NQ5A)
M4  Drain to Source Voltage (Vdss): 60V  [DQJ8]  (hidden comment: CSD18537NQ5A)
R6  Resistance: 2.74k  [RESC2012N(0805")]  (hidden comment: ERJ-6ENF2741V)
R7  Resistance: 191k  [RESC2012N(0805")]  (hidden comment: ERJ-6ENF1913V)
R8  Resistance: 10k  [RESC2012N(0805")]  (hidden comment: CRCW080510K0FKEA)
R9  Resistance: 69.8k  [RESC2012N(0805")]  (hidden comment: ERJ-6ENF6982V)
R10  Resistance: 1.74k  [RESC2012N(0805")]  (hidden comment: ERJ6ENF1741V)
R11  Resistance: 73.2k  [RESC2012N(0805")]  (hidden comment: ERJ-6ENF7322V)
R12  Resistance: 10k  [RESC2012N(0805")]  (hidden comment: CRCW080510K0FKEA)
RL1  Resistance: 40.2k  [RESC1608N(0603")]  (hidden comment: ERA3AEB4022V)
RL2  Resistance: 43.2k  [RESC1608N(0603")]  (hidden comment: ERA3AEB4322V)
Ron1  Resistance: 249k  [RESC2012N(0805")]  (hidden comment: CRCW0805249KFKEA)
RS1  Resistance: 10m  [RESC6332N(2512")]  (hidden comment: CRA2512-FZ-R010ELF)
RS2  Resistance: 15m  [RESC6332N(2512")]  (hidden comment: CRA2512-FZ-R015ELF)
U2  LM3150MH/NOPB  Supplier Part Number 1: LM3150MH/NOPB-ND  [PWP0014A_M]
U3  Part Number: INA139NA/3K  [DBV5-M]
U4  OPA340NA/3K  [DBV0005A_M]  (value not drawn)
U5  LD39050PU33R  [LDO3_3-DFN6D_M]
U6  LM3150MH/NOPB  Supplier Part Number 1: LM3150MH/NOPB-ND  [PWP0014A_M]
U7  Part Number: INA139NA/3K  [DBV5-M]
U8  OPA340NA/3K  [DBV0005A_M]  (value not drawn)

### Blocks framed on the sheet
12V - 8A Converter: C7-C14 C26 C32 Css1 Cvcc1 L1 M1 M2 R6-R8 RL1 Ron1 RS1 U2-U4
5V - 5A Converter: C15-C17 C22-C25 C33 C34 Css2 Cvcc2 L2 M3 M4 R9-R12 RL2 RS2 U6-U8
3V - 500mA LDO: C18-C21 U5

### Ports
CURR_MON_5V (out), CURR_MON_12V (out)

### Nets
3.3VDC: C20.2 C21.2 U4.5(V+) U5.4(VOUT) U8.5(V+)
5VDC: C18.2 C19.2 C23.1 C24.1 C25.2 R11.2 RS2.2 U5.1(EN) U5.6(VIN) U7.4(VIN-) U7.5(V+)
12VDC: C11.1 C12.1 C13.1 C14.2 R7.2 RS1.2 U3.4(VIN-) U3.5(V+)
GND: C7.1 C8.1 C9.1 C11.2 C12.2 C13.2 C15.1 C16.1 C17.1 C18.1 C19.1 C20.1 C21.1 C23.2 C24.2 C26.1 C32.1 C33.1 C34.1 Css1.1 Css2.1 Cvcc1.1 Cvcc2.1 M2.1(S) M2.2(S) M2.3(S) M4.1(S) M4.2(S) M4.3(S) R8.1 R12.1 RL1.1 RL2.1 U2.5(SGND) U2.9(SGND) U2.14(PGND) U2.15(DAP) U3.2(GND) U4.2(V-) U5.2(GND) U5.7(EP) U6.5(SGND) U6.9(SGND) U6.14(PGND) U6.15(DAP) U7.2(GND) U8.2(V-)
VBATT: C7.2 C8.2 C9.2 C15.2 C16.2 C17.2 C26.2 C32.2 C33.2 C34.2 M1.5(D) M1.6(D) M1.7(D) M1.8(D) M3.5(D) M3.6(D) M3.7(D) M3.8(D) R9.2 Ron1.2 U2.2(VIN) U6.2(VIN)
5V_Buck_Feedback: C25.1 R11.1 R12.2 U6.4(FB)
12V_Buck_Feedback: C14.1 R7.1 R8.2 U2.4(FB)
CURR_MON_5V: U8.1(OUT) U8.4(IN-) ; port CURR_MON_5V
CURR_MON_12V: U4.1(OUT) U4.4(IN-) ; port CURR_MON_12V
NetC10_1: C10.1 L1.1 M1.1(S) M1.2(S) M1.3(S) M2.5(D) M2.6(D) M2.7(D) M2.8(D) R6.2 U2.10(SW)
NetC10_2: C10.2 U2.12(BST)
NetC22_1: C22.1 L2.1 M3.1(S) M3.2(S) M3.3(S) M4.5(D) M4.6(D) M4.7(D) M4.8(D) R10.2 U6.10(SW)
NetC22_2: C22.2 U6.12(BST)
NetCss1_2: Css1.2 U2.6(SS)
NetCss2_2: Css2.2 U6.6(SS)
NetCvcc1_2: Cvcc1.2 U2.1(VCC)
NetCvcc2_2: Cvcc2.2 U6.1(VCC)
NetL1_2: L1.2 RS1.1 U3.3(VIN+)
NetL2_2: L2.2 RS2.1 U7.3(VIN+)
NetM1_4: M1.4(G) U2.11(HG)
NetM2_4: M2.4(G) U2.13(LG)
NetM3_4: M3.4(G) U6.11(HG)
NetM4_4: M4.4(G) U6.13(LG)
NetR6_1: R6.1 U2.8(ILIM)
NetR9_1: R9.1 U6.7(RON)
NetR10_1: R10.1 U6.8(ILIM)
NetRL1_2: RL1.2 U3.1(OUT) U4.3(IN+)
NetRL2_2: RL2.2 U7.1(OUT) U8.3(IN+)
NetRon1_1: Ron1.1 U2.7(RON)

Not connected (* = marked no-connect by the designer): U2 3(EN)*; U5 3(PG)* 5(NC)*; U6 3(EN)*

### Notes on the sheet
- Place Together
- (near RS1) Current Monitor
- (near Cvcc1) Vcc = 5.95V
- ADC Buffer
- Current Monitor
- (near Cvcc2) Vcc = 5.95V